# EasyEDA schematic SCH_Business-card-2_2024-04-09.json
TITLE: Sheet_1; REV: 1.0; Date: 2024-04-08; Sheet: 1/1; Drawn By: wizardcatz123; Company: Your Company
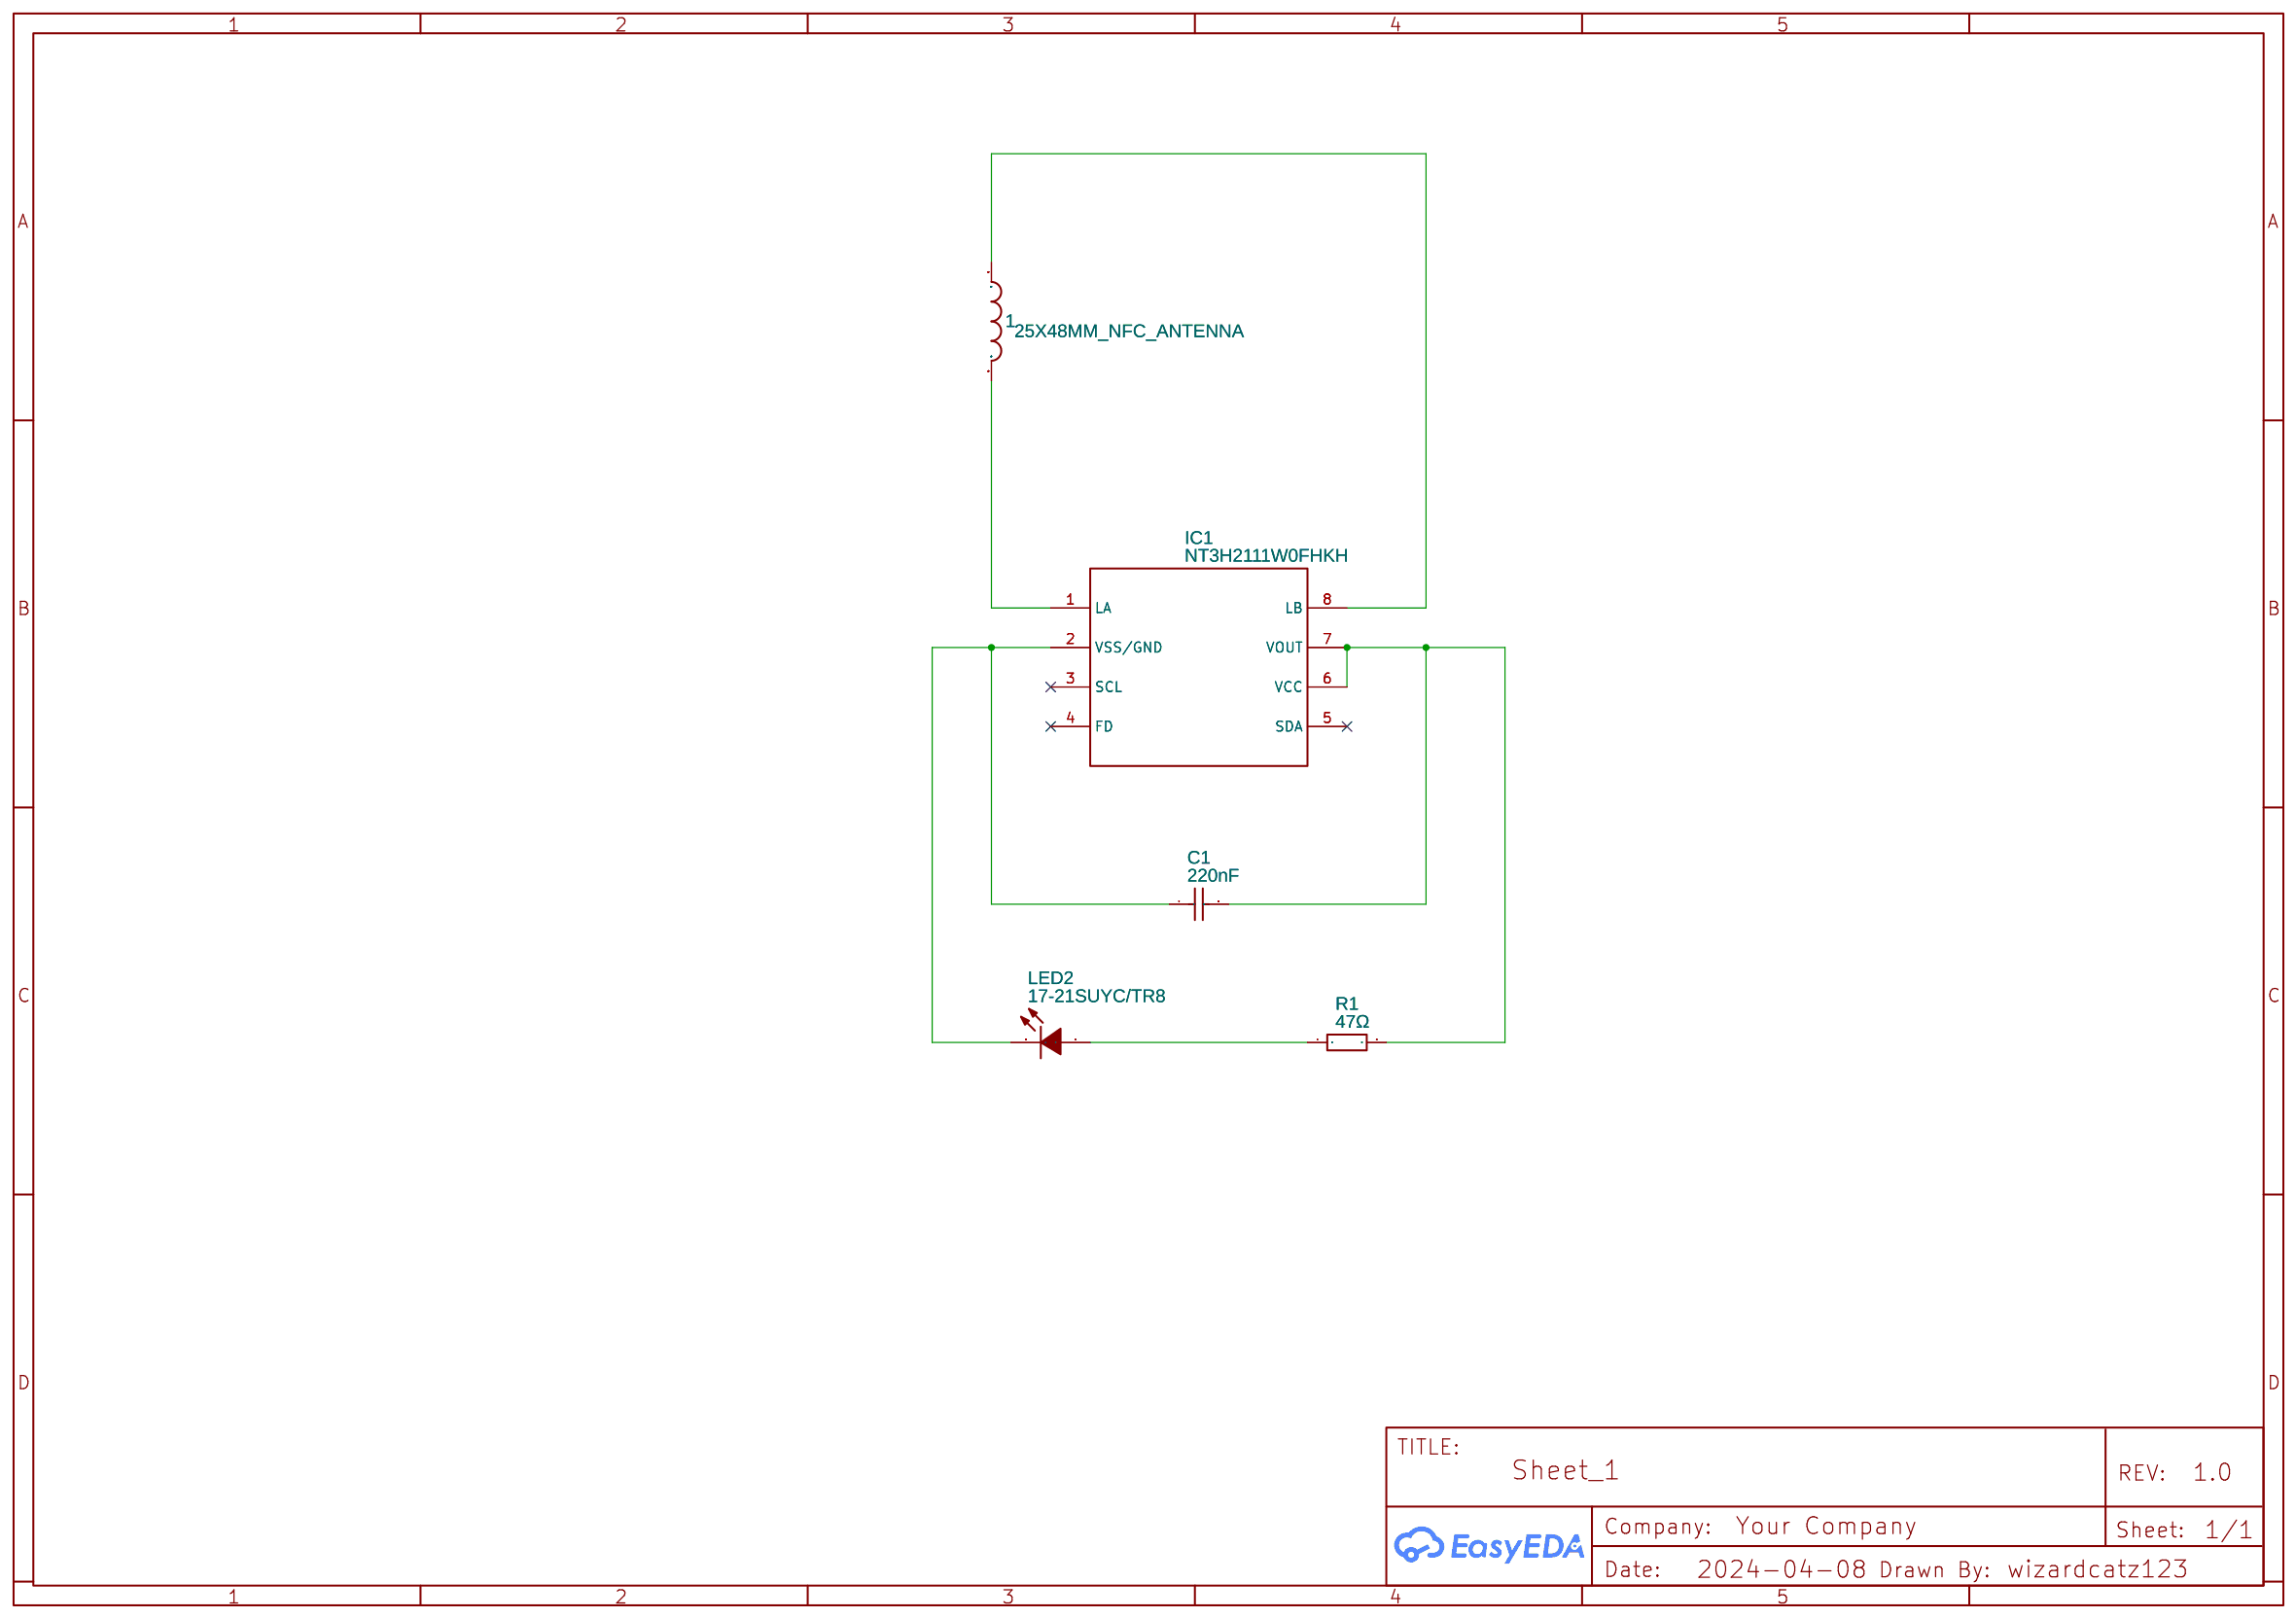
[diagram p0: schematic sheet]

## Parts
1  25X48MM_NFC_ANTENNA  [25X48MM_NFC_ANTENNA]
C1  220nF  [C0603]
IC1  NT3H2111W0FHKH  [QFN50P160X160X50-8N]
LED2  17-21SUYC/TR8  [LED0805-R-RD]
R1  47Ω  [R0603 LOCAL]

## Library data of the parts
1 = 25X48MM_NFC_ANTENNA: Contributor: maggie.j.liu
C1 = 0603C-220nF_CL10B224KA8NNNC: Supplier: LCSC; Manufacturer Part: CL10B224KA8NNNC; Manufacturer: SAMSUNG; Supplier Part: C21120; JLCPCB Part Class: Basic Part
IC1 = NT3H2111W0FHKH: Contributor: Gerriko io
LED2 = 17-21SUYC/TR8: Supplier: LCSC; Manufacturer: KENTO; Manufacturer Part: KT-0805黄灯; Supplier Part: C2296; JLCPCB Part Class: Basic Part; link: https://lcsc.com/eda_search?q=C2296&%26type=1&ref=editor; Contributor: tescojim
R1 = 0603WAF470JT5E: Supplier: LCSC; Manufacturer: UNI-ROYAL(厚声); Supplier Part: C23182; JLCPCB Part Class: Basic Part

## Nets
Net-(1-P$1): 1.P$1 IC1.8(LB)
Net-(1-P$2): 1.P$2 IC1.1(LA)
Net-(C1-1): C1.1 IC1.2(VSS/GND) LED2.2(-)
Net-(C1-2): C1.2 IC1.6(VCC) IC1.7(VOUT) R1.2
Net-(LED2-1): LED2.1(+) R1.1

Not connected (* = marked no-connect by the designer): IC1 3(SCL)* 4(FD)* 5(SDA)*
